# Altium schematic sheet 6N1381_6N138.schdoc
size 127 x 99 mm
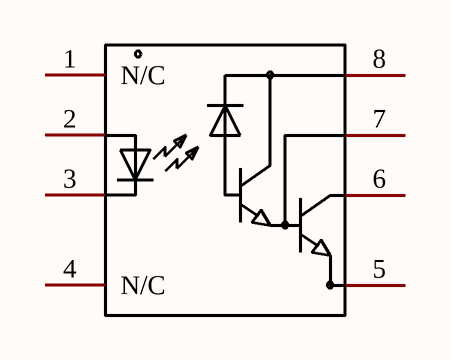
[diagram p0: 6N1381_6N138.schdoc]

## Parts
U?  6N138  (value not drawn)

## Nets

Not connected (* = marked no-connect by the designer): U? 1(N/C) 2(A) 3(C) 4(N/C) 5(GND) 6(VOUT) 7(VB) 8(VCC)

## Library data of the parts
U? = 6N138: Manufacturer: ISOCOM(英国安数光); Add into BOM: yes; Symbol: 6N138; Device: 6N138; LCSC Part Name: 6N138; Supplier Part: C255743; Manufacturer Part: 6N138; Supplier Footprint: DIP-8; JLCPCB Part Class: Extended Part; Datasheet: https://atta.szlcsc.com/upload/public/pdf/source/20180822/C255743_18671C8E554C080D6DA42199C3C846EF.pdf; Supplier: LCSC; Convert to PCB: yes